# EAGLE schematic untitled (EAGLE 9.6.2)

## Sheet 1 of 2
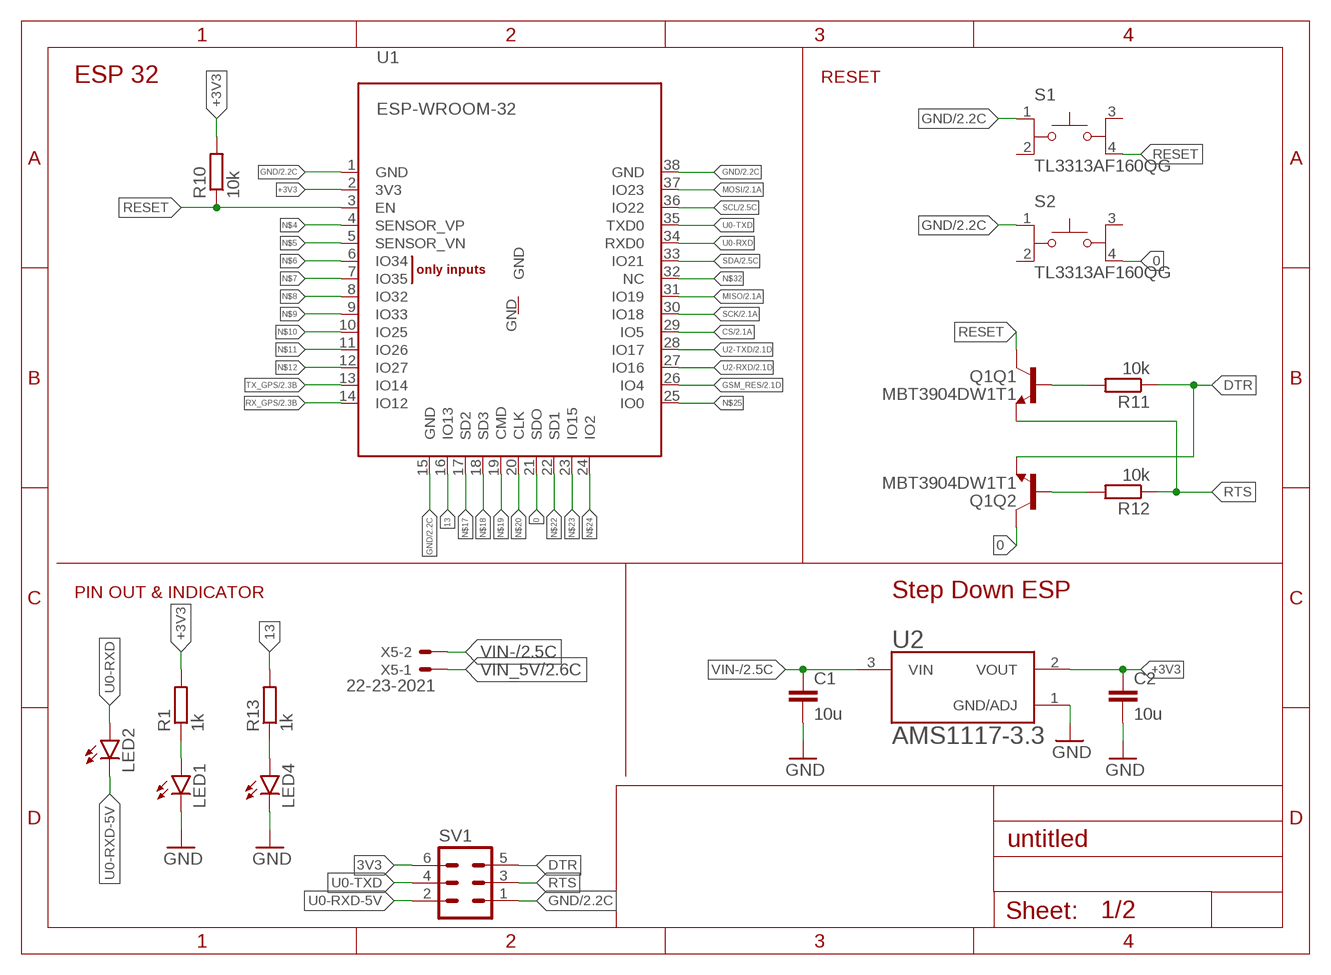
[diagram p0: schematic, sheet 1]

### Parts
C1  10u  C-EUC0805K  [C0805K]
C2  10u  C-EUC0805K  [C0805K]
LED1  LEDCHIPLED_0805  [CHIPLED_0805]
LED2  LEDCHIPLED_0805  [CHIPLED_0805]
LED4  LEDCHIPLED_0805  [CHIPLED_0805]
Q1  MBT3904DW1T1  [SC70-6]
R1  1k  R-EU_M0805  [M0805]
R10  10k  R-EU_M0805  [M0805]
R11  10k  R-EU_M0805  [M0805]
R12  10k  R-EU_M0805  [M0805]
R13  1k  R-EU_M0805  [M0805]
S1  TL3313AF160QG  [SW_TL3313AF160QG]
S2  TL3313AF160QG  [SW_TL3313AF160QG]
SV1  MA03-2  [MA03-2]
U1  ESP-WROOM-32  [ESP-WROOM-32]
U2  AMS1117-3.3  [SOT229P700X180-4N]
X5  22-23-2021  [22-23-2021]

### Nets
0: Q1.6(Q2:C) S2.4 U1.21(SDO)
3V3: SV1.6
13: R13.2 U1.16(IO13)
+3V3: C2.1 R1.2 R10.2 U1.2(3V3) U2.2(VOUT)
CS: U1.29(IO5) ; also sheet 2
DTR: Q1.1(Q2:E) R11.1 SV1.5
GND: C1.2 C2.2 LED1.C LED4.C S1.1 S2.1 SV1.1 U1.1(GND) U1.15(GND) U1.38(GND) U2.1(GND/ADJ) ; also sheet 2
GSM_RES: U1.26(IO4) ; also sheet 2
MISO: U1.31(IO19) ; also sheet 2
MOSI: U1.37(IO23) ; also sheet 2
N$4: U1.4(SENSOR_VP)
N$5: U1.5(SENSOR_VN)
N$6: U1.6(IO34)
N$7: U1.7(IO35)
N$8: U1.8(IO32)
N$9: U1.9(IO33)
N$10: U1.10(IO25)
N$11: U1.11(IO26)
N$12: U1.12(IO27)
N$15: LED1.A R1.1
N$16: LED4.A R13.1
N$17: U1.17(SD2)
N$18: U1.18(SD3)
N$19: U1.19(CMD)
N$20: U1.20(CLK)
N$22: U1.22(SD1)
N$23: U1.23(IO15)
N$24: U1.24(IO2)
N$25: U1.25(IO0)
N$30: Q1.2(Q2:B) R12.2
N$31: Q1.5(Q1:B) R11.2
N$32: U1.32(NC)
RESET: Q1.3(Q1:C) R10.1 S1.4 U1.3(EN)
RTS: Q1.4(Q1:E) R12.1 SV1.3
RX_GPS: U1.14(IO12) ; also sheet 2
SCK: U1.30(IO18) ; also sheet 2
SCL: U1.36(IO22) ; also sheet 2
SDA: U1.33(IO21) ; also sheet 2
TX_GPS: U1.13(IO14) ; also sheet 2
U0-RXD: LED2.A U1.34(RXD0)
U0-RXD-5V: LED2.C SV1.2
U0-TXD: SV1.4 U1.35(TXD0)
U2-RXD: U1.27(IO16) ; also sheet 2
U2-TXD: U1.28(IO17) ; also sheet 2
VIN-: C1.1 U2.3(VIN) X5.2 ; also sheet 2
VIN_5V: X5.1 ; also sheet 2
Unconnected: S1.2 S1.3 S2.2 S2.3 U1.GND

### Notes on the sheet
- ESP 32 | RESET
- PIN OUT & INDICATOR | Step Down ESP

## Sheet 2 of 2
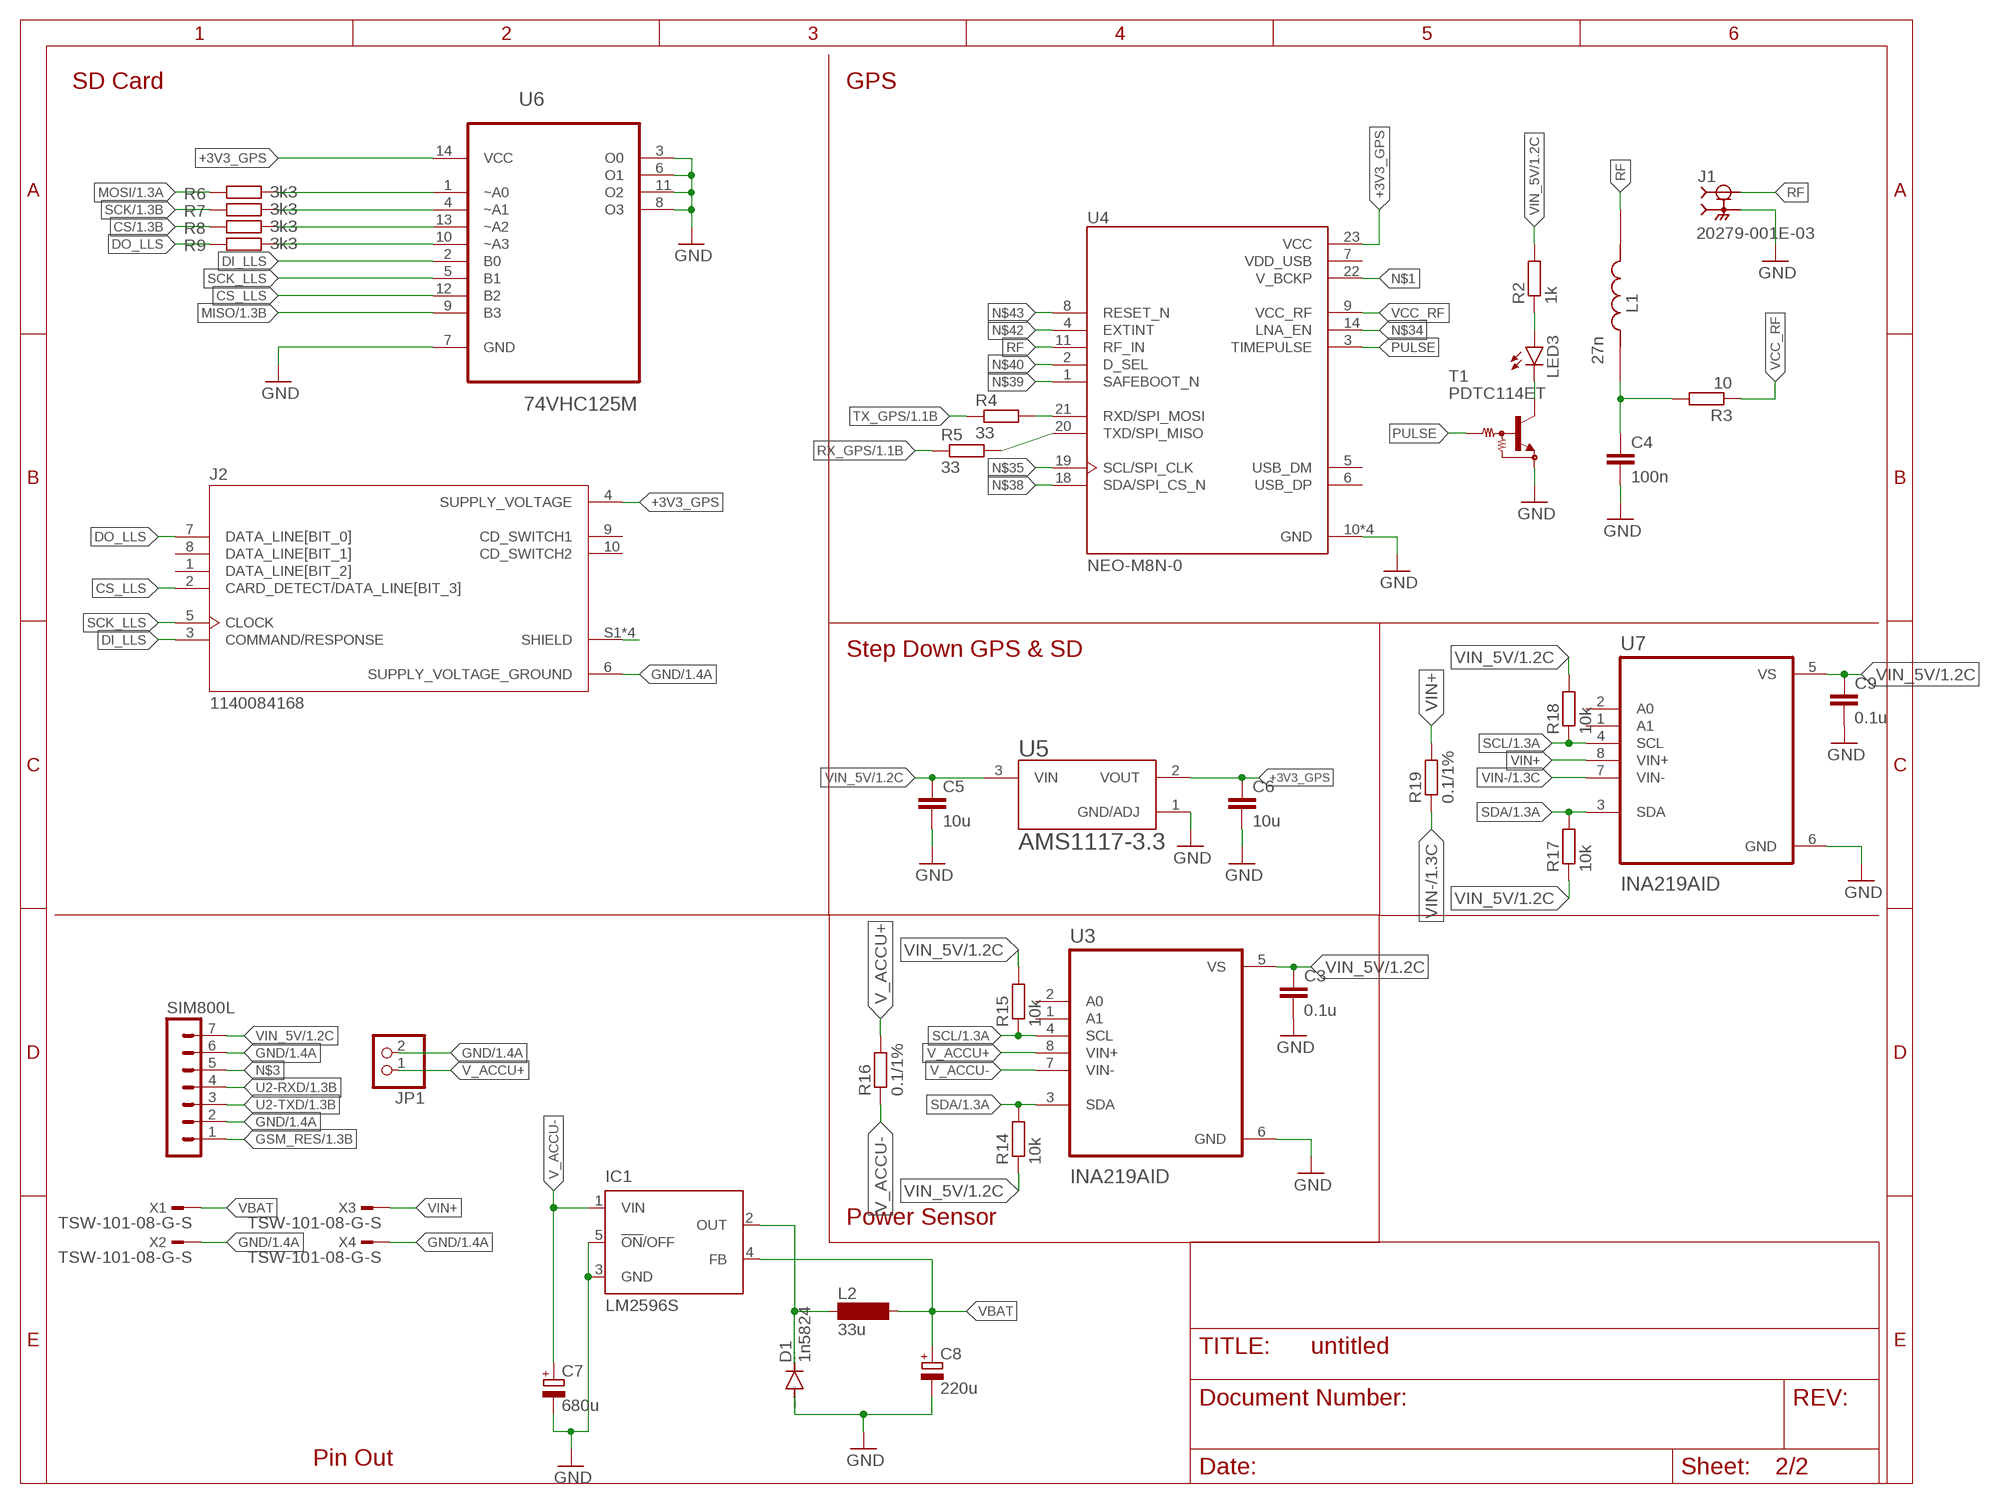
[diagram p1: schematic, sheet 2]

### Parts
C3  0.1u  C-EUC0805  [C0805]
C4  100n  C-EUC0603K  [C0603K]
C5  10u  C-EUC0805K  [C0805K]
C6  10u  C-EUC0805K  [C0805K]
C7  680u  CPOL-EU153CLV-0605  [153CLV-0605]
C8  220u  CPOL-EU153CLV-0605  [153CLV-0605]
C9  0.1u  C-EUC0805  [C0805]
D1  1n5824  DIODE-DO-214AC  [DO-214AC]
IC1  LM2596S  [TO263-5]
J1  20279-001E-03  [IPEX_20279-001E-03]
J2  1140084168  [AMPHENOL_1140084168]
JP1  PINHD-1X2  [1X02]
L1  27n  MLZ2012A1R0WT000  [INDC2012X105N]
L2  33u  MS85  [MS85]
LED3  LEDCHIPLED_0805  [CHIPLED_0805]
R2  1k  R-EU_M0805  [M0805]
R3  10  R-EU_M1206  [M1206]
R4  33  R-EU_R1206  [R1206]
R5  33  R-EU_R1206  [R1206]
R6  3k3  R-EU_M0805  [M0805]
R7  3k3  R-EU_M0805  [M0805]
R8  3k3  R-EU_M0805  [M0805]
R9  3k3  R-EU_M0805  [M0805]
R14  10k  R-EU_M0805  [M0805]
R15  10k  R-EU_M0805  [M0805]
R16  0.1/1%  R-EU_M1206  [M1206]
R17  10k  R-EU_M0805  [M0805]
R18  10k  R-EU_M0805  [M0805]
R19  0.1/1%  R-EU_M1206  [M1206]
SIM800L  MA07-1  [MA07-1]
T1  PDTC114ET  MUN2211T1-NPN_DRIVER-SC59-BEC  [SC59-BEC]
U3  INA219AID  [SOIC127P599X175-8N]
U4  NEO-M8N-0  [XCVR_NEO-M8N-0]
U5  AMS1117-3.3  [SOT229P700X180-4N]
U6  74VHC125M  [SOIC127P600X175-14N]
U7  INA219AID  [SOIC127P599X175-8N]
X1  TSW-101-08-G-S  [TSW-101-XX-G-S]
X2  TSW-101-08-G-S  [TSW-101-XX-G-S]
X3  TSW-101-08-G-S  [TSW-101-XX-G-S]
X4  TSW-101-08-G-S  [TSW-101-XX-G-S]

### Nets
+3V3_GPS: C6.1 J2.4(SUPPLY_VOLTAGE) U4.23(VCC) U5.2(VOUT) U6.14(VCC)
CS: R8.1 ; also sheet 1
CS_LLS: J2.2(CARD_DETECT/DATA_LINE[BIT_3]) U6.12(B2)
DI_LLS: J2.3(COMMAND/RESPONSE) U6.2(B0)
DO_LLS: J2.7(DATA_LINE[BIT_0]) R9.1
GND: C3.2 C4.2 C5.2 C6.2 C7.- C8.- C9.2 D1.A IC1.3(GND) IC1.5(!ON!/OFF) J1.2(GND) J1.3(GND) J2.6(SUPPLY_VOLTAGE_GROUND) JP1.2 SIM800L.2 SIM800L.6 T1.E U3.6(GND) U4.10(GND) U4.12(GND) U4.13(GND) U4.24(GND) U5.1(GND/ADJ) U6.3(O0) U6.6(O1) U6.7(GND) U6.8(O3) U6.11(O2) U7.6(GND) X2.1 X4.1 ; also sheet 1
GSM_RES: SIM800L.1 ; also sheet 1
MISO: U6.9(B3) ; also sheet 1
MOSI: R6.1 ; also sheet 1
N$1: U4.22(V_BCKP)
N$2: LED3.A R2.1
N$3: SIM800L.5
N$13: LED3.C T1.C
N$14: J2.S1(SHIELD) J2.S2(SHIELD) J2.S3(SHIELD) J2.S4(SHIELD)
N$26: R5.2 U4.20(TXD/SPI_MISO)
N$27: R4.2 U4.21(RXD/SPI_MOSI)
N$28: D1.C IC1.2(OUT) L2.1
N$34: U4.14(LNA_EN)
N$35: U4.19(SCL/SPI_CLK)
N$38: U4.18(SDA/SPI_CS_N)
N$39: U4.1(SAFEBOOT_N)
N$40: U4.2(D_SEL)
N$42: U4.4(EXTINT)
N$43: U4.8(RESET_N)
N$47: R9.2 U6.10(~A3)
N$48: R8.2 U6.13(~A2)
N$49: R7.2 U6.4(~A1)
N$50: R6.2 U6.1(~A0)
PULSE: T1.B U4.3(TIMEPULSE)
RF: J1.1(SIG) L1.2 U4.11(RF_IN)
RF_: C4.1 L1.1 R3.2
RX_GPS: R5.1 ; also sheet 1
SCK: R7.1 ; also sheet 1
SCK_LLS: J2.5(CLOCK) U6.5(B1)
SCL: R15.1 R18.1 U3.4(SCL) U7.4(SCL) ; also sheet 1
SDA: R14.2 R17.2 U3.3(SDA) U7.3(SDA) ; also sheet 1
TX_GPS: R4.1 ; also sheet 1
U2-RXD: SIM800L.4 ; also sheet 1
U2-TXD: SIM800L.3 ; also sheet 1
V_ACCU+: JP1.1 R16.2 U3.8(VIN+)
V_ACCU-: C7.+ IC1.1(VIN) R16.1 U3.7(VIN-)
VBAT: C8.+ IC1.4(FB) L2.2 X1.1
VCC_RF: R3.1 U4.9(VCC_RF)
VIN+: R19.2 U7.8(VIN+) X3.1
VIN-: R19.1 U7.7(VIN-) ; also sheet 1
VIN_5V: C3.1 C5.1 C9.1 R2.2 R14.1 R15.2 R17.1 R18.2 SIM800L.7 U3.5(VS) U5.3(VIN) U7.5(VS) ; also sheet 1
Unconnected: J2.1(DATA_LINE[BIT_2]) J2.8(DATA_LINE[BIT_1]) J2.9(CD_SWITCH1) J2.10(CD_SWITCH2) U3.1(A1) U3.2(A0) U4.5(USB_DM) U4.6(USB_DP) U7.1(A1) U7.2(A0)

### Notes on the sheet
- SD Card | GPS
- Step Down GPS & SD
- Power Sensor
- Pin Out

## Power pins joined to a net without a drawn wire
VDD_USB: U4.7(VDD_USB)

## Library data of the parts
C1-C6 C9 = rcl:C-EU: CAPACITOR, European symbol; SPICEPREFIX: C
C7 C8 = rcl:CPOL-EU: POLARIZED CAPACITOR, European symbol; SPICEPREFIX: C
D1 = diode:DIODE-: DIODE
IC1 = national-semiconductor:LM2596: SIMPLE SWITCHER® Power Converter 150 kHz 3A Step-Down Voltage Regulator Source: http://www.national.com/ds/LM/LM2596.pdf; MF: NATIONAL SEMICONDUCTOR; MPN: LM2596S-ADJ/NOPB; OC_FARNELL: 9494367; OC_NEWARK: 41K3842
J1 = 20279-001E-03:20279-001E-03: Wire to board connector for coaxial cable Check availability <https://pricing.snapeda.com/parts/20279-001E-03/I-PEX/view-part?ref=eda>; AVAILABILITY: In Stock; CHECK_PRICES: https://www.snapeda.com/parts/20279-001E-03/I-PEX/view-part/?ref=eda; DESCRIPTION: 1 POS Vertical SMD Small form factor with big performance through 6 GHz connector,MHF, RF, micro-coaxial MHF I Receptacle; MF: I-PEX; MP: 20279-001E-03; PACKAGE: None; PRICE: None; PURCHASE-URL: https://www.snapeda.com/api/url_track_click_mouser/?unipart_id=3221458&manufacturer=I-PEX&part_name=20279-001E-03&search_term=ipex; SNAPEDA_LINK: https://www.snapeda.com/parts/20279-001E-03/I-PEX/view-part/?ref=snap
J2 = 1140084168:1140084168: Conn; IC Socket; Micro SD; Right Angle; PCB Mount; MicroSD Ser.; CHECK_PRICES: https://www.snapeda.com/parts/114-00841-68/Amphenol/view-part/?ref=eda; DESCRIPTION: 10 (8 + 2) Position Card Connector Secure Digital - microSD™ Surface Mount, Right Angle Gold; MF: Amphenol ICC (Commercial Products); MP: 114-00841-68; PACKAGE: None; SNAPEDA_LINK: https://www.snapeda.com/parts/114-00841-68/Amphenol/view-part/?ref=snap
JP1 = pinhead:PINHD-1X2: PIN HEADER
L1 = MLZ2012A1R0WT000:MLZ2012A1R0WT000: 1µH Shielded Multilayer Inductor 900mA 100mOhm 0805 (2012 Metric) Check availability <https://pricing.snapeda.com/parts/MLZ2012A1R0WT000/TDK/view-part?ref=eda>; AVAILABILITY: In Stock; CHECK_PRICES: https://www.snapeda.com/parts/MLZ2012A1R0WT000/TDK/view-part/?ref=eda; DESCRIPTION: 1 µH Shielded Multilayer Inductor 900 mA 100mOhm 0805 (2012 Metric); MF: TDK; MP: MLZ2012A1R0WT000; PACKAGE: 0805 TDK; PRICE: None; PURCHASE-URL: https://www.snapeda.com/api/url_track_click_mouser/?unipart_id=1502676&manufacturer=TDK&part_name=MLZ2012A1R0WT000&search_term=0805 inductor; SNAPEDA_LINK: https://www.snapeda.com/parts/MLZ2012A1R0WT000/TDK/view-part/?ref=snap
L2 = inductor-neosid:MS85: INDUCTOR SMD power inductor; OC_FARNELL: unknown; OC_NEWARK: unknown
LED1-LED4 = led:LED: LED OSRAM: - CHIPLED LG R971, LG N971, LY N971, LG Q971, LY Q971, LO R971, LY R971 LH N974, LH R974 LS Q976, LO Q976, LY Q976 LO Q996 - Hyper CHIPLED LW Q18S LB Q993, LB Q99A, LB R99A - SideLED LS A670, LO A670, LY A670, LG A670, LP A670 LB A673, LV A673, LT A673, LW A673 LH A674 LY A675 LS A676, LA A676, LO A676, LY A676, LW A676 LS A679, LY A679, LG A679 - Hyper Micro SIDELED® LS Y876, LA Y876, LO Y876, LY Y876 LT Y87S - SmartLED LW L88C, LW L88S LB L89C, LB L89S, LG L890 LS L89K, LO L89K, LY L89K LS L896, LA L896, LO L896, LY L896 - TOPLED LS T670, LO T670, LY T670, LG T670, LP T670 LSG T670, LSP T670, LSY T670, LOP T670, LYG T670 LG T671, LOG T671, LSG T671 LB T673, LV T673, LT T673, LW T673 LH T674 LS T676, LA T676, LO T676, LY T676, LB T676, LH T676, LSB T676, LW T676 LB T67C, LV T67C, LT T67C, LS T67K, LO T67K, LY T67K, LW E67C LS E67B, LA E67B, LO E67B, LY E67B, LB E67C, LV E67C, LT E67C LW T67C LS T679, LY T679, LG T679 LS T770, LO T770, LY T770, LG T770, LP T770 LB T773, LV T773, LT T773, LW T773 LH T774 LS E675, LA E675, LY E675, LS T675 LS T776, LA T776, LO T776, LY T776, LB T776 LHGB T686 LT T68C, LB T68C - Hyper Mini TOPLED® LB M676 - Mini TOPLED Santana® LG M470 LS M47K, LO M47K, LY M47K Source: http://www.osram.convergy.de LUXEON: - LUMILED® LXK2-PW12-R00, LXK2-PW12-S00, LXK2-PW14-U00, LXK2-PW14-V00 LXK2-PM12-R00, LXK2-PM12-S00, LXK2-PM14-U00 LXK2-PE12-Q00, LXK2-PE12-R00, LXK2-PE12-S00, LXK2-PE14-T00, LXK2-PE14-U00 LXK2-PB12-K00, LXK2-PB12-L00, LXK2-PB12-M00, LXK2-PB14-N00, LXK2-PB14-P00, LXK2-PB14-Q00 LXK2-PR12-L00, LXK2-PR12-M00, LXK2-PR14-Q00, LXK2-PR14-R00 LXK2-PD12-Q00, LXK2-PD12-R00, LXK2-PD12-S00 LXK2-PH12-R00, LXK2-PH12-S00 LXK2-PL12-P00, LXK2-PL12-Q00, LXK2-PL12-R00 Source: www.luxeon.com KINGBRIGHT: KA-3528ASYC Source: www.kingbright.com
Q1 = MBT3904DW1T1:MBT3904DW1T1: MBT3904DW1 Dual NPN Transistors The MBT3904W1 puts two general purpose 3904 NPN transistors in a single package. Datasheet <http://www.onsemi.com/pub_link/Collateral/MBT3904DW1T1-D.PDF> Check availability <https://pricing.snapeda.com/parts/MBT3904DW1T1/ON%20Semiconductor/view-part?ref=eda>; AVAILABILITY: In Stock; CHECK_PRICES: https://www.snapeda.com/parts/MBT3904DW1T1/Onsemi/view-part/?ref=eda; DESCRIPTION: Bipolar (BJT) Transistor Array 2 NPN (Dual) 40V 200mA 300MHz 150mW Surface Mount SC-88/SC70-6/SOT-363; MF: ON Semiconductor; MP: MBT3904DW1T1; PACKAGE: SC-88-6 ON Semiconductor; PRICE: None; PURCHASE-URL: https://www.snapeda.com/api/url_track_click_mouser/?unipart_id=563485&manufacturer=ON Semiconductor&part_name=MBT3904DW1T1&search_term=mbt3904dw1t1; SNAPEDA_LINK: https://www.snapeda.com/parts/MBT3904DW1T1/Onsemi/view-part/?ref=snap
R1-R19 = rcl:R-EU_: RESISTOR, European symbol; SPICEPREFIX: R
S1 S2 = TL3313AF160QG:TL3313AF160QG: Check availability <https://pricing.snapeda.com/parts/TL3313AF160QG/E-Switch/view-part?ref=eda>; AVAILABILITY: In Stock; CHECK_PRICES: https://www.snapeda.com/parts/TL3313AF160QG/E-Switch/view-part/?ref=eda; DESCRIPTION: SWITCH TACTILE SPST-NO 0.05A 12V; MF: E-Switch; MP: TL3313AF160QG; PACKAGE: None; PRICE: None; PURCHASE-URL: https://www.snapeda.com/api/url_track_click_mouser/?unipart_id=3210709&manufacturer=E-Switch&part_name=TL3313AF160QG&search_term=tactile; SNAPEDA_LINK: https://www.snapeda.com/parts/TL3313AF160QG/E-Switch/view-part/?ref=snap
SIM800L = con-lstb:MA07-1: PIN HEADER; OC_FARNELL: unknown; OC_NEWARK: unknown
SV1 = con-lstb:MA03-2: PIN HEADER; OC_FARNELL: unknown; OC_NEWARK: unknown
T1 = transistor:*-NPN_DRIVER-: NPN Bias Resistor Transistor
U1 = esp32:ESP-WROOM-32
U2 U5 = AMS1117-3.3:AMS1117-3.3: Check availability <https://pricing.snapeda.com/parts/AMS1117-3.3/Advanced%20Monolithic%20Systems/view-part?ref=eda>; AVAILABILITY: Not in stock; CHECK_PRICES: https://www.snapeda.com/parts/AMS1117-3.3/Advanced+Monolithic+Systems/view-part/?ref=eda; DESCRIPTION: Sot223/Pkg 1-Amp 3.3-Volt Low Drop Out Voltage Regulatator; MF: Advanced Monolithic Systems; MP: AMS1117-3.3; PACKAGE: SOT-223 Seeed Technology; PRICE: None; SNAPEDA_LINK: https://www.snapeda.com/parts/AMS1117-3.3/Advanced+Monolithic+Systems/view-part/?ref=snap
U3 U7 = INA219AID:INA219AID; CHECK_PRICES: https://www.snapeda.com/parts/INA219AID/Texas+Instruments/view-part/?ref=eda; DESCRIPTION: 26V, 12-bit, i2c output current/voltage/power monitor; MF: Texas Instruments; MP: INA219AID; PACKAGE: SOIC-8 Texas Instruments; PURCHASE-URL: https://www.snapeda.com/api/url_track_click_mouser/?unipart_id=522322&manufacturer=Texas Instruments&part_name=INA219AID&search_term=ina219; SNAPEDA_LINK: https://www.snapeda.com/parts/INA219AID/Texas+Instruments/view-part/?ref=snap
U4 = NEO-M8N-0:NEO-M8N-0: Ic Receiver Gps/Gnss 24lcc Check availability <https://pricing.snapeda.com/parts/NEO-M8N-0/U-Blox%20America/view-part?ref=eda>; AVAILABILITY: In Stock; CHECK_PRICES: https://www.snapeda.com/parts/NEO-M8N-0/U-Blox+America+Inc./view-part/?ref=eda; DESCRIPTION: series RF Receiver BeiDou, Galileo, GLONASS, GNSS, GPS 1.575GHz -167dBm - - -; MF: U-Blox America; MP: NEO-M8N-0; PACKAGE: SMD-24 U-Blox America Inc.; PRICE: None; PURCHASE-URL: https://www.snapeda.com/api/url_track_click_mouser/?unipart_id=556953&manufacturer=U-Blox America&part_name=NEO-M8N-0&search_term=neo m8n; SNAPEDA_LINK: https://www.snapeda.com/parts/NEO-M8N-0/U-Blox+America+Inc./view-part/?ref=snap
U6 = 74VHC125M:74VHC125M: Quad Buffer with 3-STATE Outputs Check availability <https://pricing.snapeda.com/parts/74VHC125M/ON%20Semiconductor/view-part?ref=eda>; AVAILABILITY: In Stock; CHECK_PRICES: https://www.snapeda.com/parts/74VHC125M/Onsemi/view-part/?ref=eda; DESCRIPTION: Buffer, Non-Inverting 4 Element 1 Bit per Element 3-State Output 14-TSSOP; MF: ON Semiconductor; MP: 74VHC125M; PACKAGE: SOIC-14 ON Semiconductor; PRICE: None; PURCHASE-URL: https://www.snapeda.com/api/url_track_click_mouser/?unipart_id=1808470&manufacturer=ON Semiconductor&part_name=74VHC125M&search_term=74vhc125; SNAPEDA_LINK: https://www.snapeda.com/parts/74VHC125M/Onsemi/view-part/?ref=snap
X1-X4 = con-samtec:TSW-101-*-G-S: THROUGH-HOLE .025" SQ POST HEADER Source: Samtec TSW.pdf; MF: Samtec Inc.; MPN: TSW-101-07-G-S
X5 = con-molex:22-23-2021: .100" (2.54mm) Center Header - 2 Pin; MF: MOLEX; MPN: 22-23-2021; OC_FARNELL: 1462926; OC_NEWARK: 25C3832

## Net classes
0 default: width 0.279 mm, clearance 0.254 mm